# Altium schematic sheet 20V Supply.SchDoc
size A
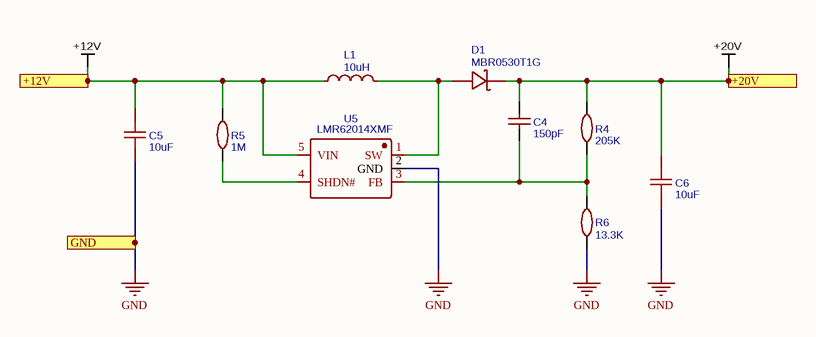
[diagram p0: 20V Supply.SchDoc]

## Parts
C4  150pF  [C0805]
C5  10uF  [C0805]
C6  10uF  [C0805]
D1  MBR0530T1G  [SOD-123_L2.8-W1.8-LS3.7-RD]
L1  10uH  [IND-SMD_L6.0-W6.0]
R4  205K  [R0603]
R5  1M  [R0603]
R6  13.3K  [R0603]
U5  LMR62014XMF  [SOT-23-5_L3.0-W1.7-P0.95-LS2.8-BR]

## Ports
+12V, +20V, GND

## Nets
+12V: C5.2 L1.1 R5.2 U5.5(VIN) ; port +12V
+20V: C4.2 C6.2 D1.1(C) R4.2 ; port +20V
GND: C5.1 C6.1 R6.1 U5.2(GND) ; port GND
NetC4_1: C4.1 R4.1 R6.2 U5.3(FB)
NetD1_2: D1.2(A) L1.2 U5.1(SW)
NetR5_1: R5.1 U5.4(SHDN#)

## Library data of the parts
C4 = 150pF: Manufacturer: YAGEO; Manufacture Part Number: CC0805JRNPO9BN151; nameAlias: Capacitance; Supplier: LCSC; Supplier Part Number: C107111; spicePre: C; spiceSymbolName: CC0805JRNPO9BN151
C5 C6 = 10uF: Manufacturer: SAMSUNG; Manufacture Part Number: CL21B106KOQNNNE; nameAlias: Capacitance; Supplier: LCSC; Supplier Part Number: C95841; spicePre: C; spiceSymbolName: CL21B106KOQNNNE
D1 = MBR0530T1G: Manufacturer: ON; SMT Type: Extend; Supplier: LCSC; Manufacture Part Number: MBR0530T1G; image: //image.lceda.cn/szlcsc/C82046.jpg; Supplier Part Number: C82046; BOM_LCSC Assembly: Yes; spicePre: D; spiceSymbolName: MBR0530T1G
L1 = 10uH: Manufacturer: TDK; Manufacture Part Number: VLS6045EX-100M; nameAlias: Inductance; Contributor: LCSC; Supplier: LCSC; Supplier Part Number: C360734; spicePre: L; spiceSymbolName: VLS6045EX-100M
R4 = 205K: Manufacturer: UniOhm; Manufacture Part Number: 0603WAF2053T5E; nameAlias: Resistance (Ohms); SMT Type: Extend; Supplier: LCSC; Supplier Part Number: C22949; BOM_LCSC Assembly: Yes; spicePre: R; spiceSymbolName: 0603WAF2053T5E
R5 = 1M: Manufacturer: UniOhm; Manufacture Part Number: 0603WAF1004T5E; nameAlias: Resistance (Ohms); SMT Type: Basic; Supplier: LCSC; BOM_LCSC Assembly: Yes; Supplier Part Number: C22935; spicePre: R; spiceSymbolName: 0603WAF1004T5E
R6 = 13.3K: Manufacturer: UniOhm; Manufacture Part Number: 0603WAF1332T5E; nameAlias: Resistance (Ohms); SMT Type: Extend; Supplier: LCSC; Supplier Part Number: C25952; BOM_LCSC Assembly: Yes; spicePre: R; spiceSymbolName: 0603WAF1332T5E
U5 = LMR62014XMF: Manufacturer: TI; SMT Type: Extend; Supplier: LCSC; Manufacture Part Number: LMR62014XMF; Supplier Part Number: C55182; BOM_LCSC Assembly: Yes; spicePre: U; spiceSymbolName: LMR62014XMF